# EAGLE design shige7seg_breakout (EAGLE 9.4.1)
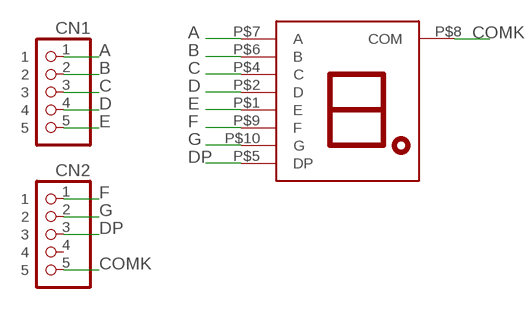
[diagram p0: schematic, sheet 1]

## Parts
CN1  CON_PINHD-1X5  [1X05R]
CN2  CON_PINHD-1X5  [1X05R]
D1  LED_7SEG  [7SEG_10X7SMD]

## Nets
A: CN1.1 D1.P$7(A)
B: CN1.2 D1.P$6(B)
C: CN1.3 D1.P$4(C)
COMK: CN2.5 D1.P$8(COM)
D: CN1.4 D1.P$2(D)
DP: CN2.3 D1.P$5(DP)
E: CN1.5 D1.P$1(E)
F: CN2.1 D1.P$9(F)
G: CN2.2 D1.P$10(G)
Unconnected: CN2.4

## Library data of the parts
CN1 CN2 = akita:CON_PINHD-1X5: PIN HEADER
D1 = akita:LED_7SEG: 7segment LED

## Board
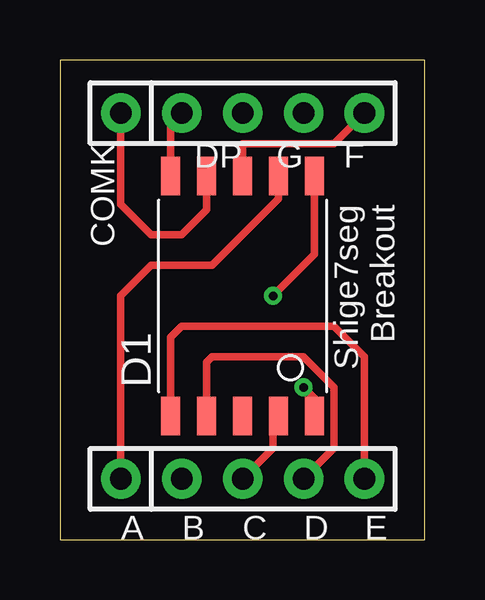
[diagram p1: board, top side]
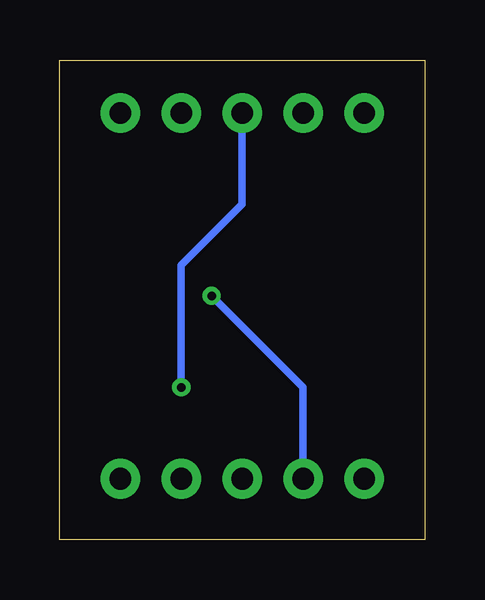
[diagram p2: board, bottom side, seen from below]

Size 15.22 x 19.99 mm. Coordinates in mm from the lower left corner, seen from the top.
Outline: 0,0 15.22,0 15.22,19.99 0,19.99 0,0
Copper layers (1*16): Top 0.035mm / dielectric 1.5mm / Bottom 0.035mm
Design rules "default": minimum track width 6mil, minimum drill 0.35mm, track to track 6mil, track to pad 6mil, pad to pad 6mil, via to via 6mil, smd to smd 6mil, copper to edge 40mil, drill to drill 6mil, minimum pad ring 10mil, minimum via ring 8mil, stop-mask expansion 4mil, vias tented up to drill 0mil, thermal gap 10mil

### Footprints (pad centres in the part's own frame; a part is rotated, then mirrored left to right if it is on the bottom)
1X05R = drill 0.9 pad 1.651: 1 0,0; 2 2.54,0; 3 5.08,0; 4 7.62,0; 5 10.16,0
7SEG_10X7SMD = smd 0.8 x 1.6: P$1 -3,-5; P$2 -1.5,-5; P$3 0,-5; P$4 1.5,-5; P$5 3,-5; P$6 3,5; P$7 1.5,5; P$8 0,5; P$9 -1.5,5; P$10 -3,5

### Placement (x,y rotation side)
CN1  2.54,2.54 0 top
CN2  2.54,17.78 0 top
D1  7.62,10.16 0 top

### Tracks (layer width: path | path; a pad name or v marks a point on that pad's centre or on a via)
A
  Top 0.305: D1.P$7 9.12,14.2 6.35,11.43 3.81,11.43 2.54,10.16 CN1.1
B  (via drill 0.35)
  Top 0.305: D1.P$6 10.62,11.89 v8.89,10.16
  Bottom 0.305: CN1.2 5.08,6.35 v8.89,10.16
C
  Top 0.305: CN1.3 8.89,3.81 8.89,4.93 D1.P$4
COMK
  Top 0.305: D1.P$8 7.62,16.51 11.43,16.51 CN2.5
D
  Top 0.305: CN1.4 11.43,3.81 11.43,6.35 10.16,7.62 6.35,7.62 6.12,7.39 D1.P$2
DP  (via drill 0.35)
  Top 0.305: v10.16,6.35 10.62,5.89 D1.P$5
  Bottom 0.305: CN2.3 7.62,13.97 10.16,11.43 v10.16,6.35
E
  Top 0.305: D1.P$1 4.62,8.43 5.08,8.89 11.43,8.89 12.7,7.62 CN1.5
F
  Top 0.305: D1.P$9 6.12,13.74 5.08,12.7 3.81,12.7 2.54,13.97 CN2.1
G
  Top 0.305: D1.P$10 4.62,17.32 CN2.2

### Text on the board
tPlace: COMK | DP | G | F | Shige7seg / Breakout | A | B | C | D | E